# Altium project Mother_board_sauvc_2025.PrjPcb
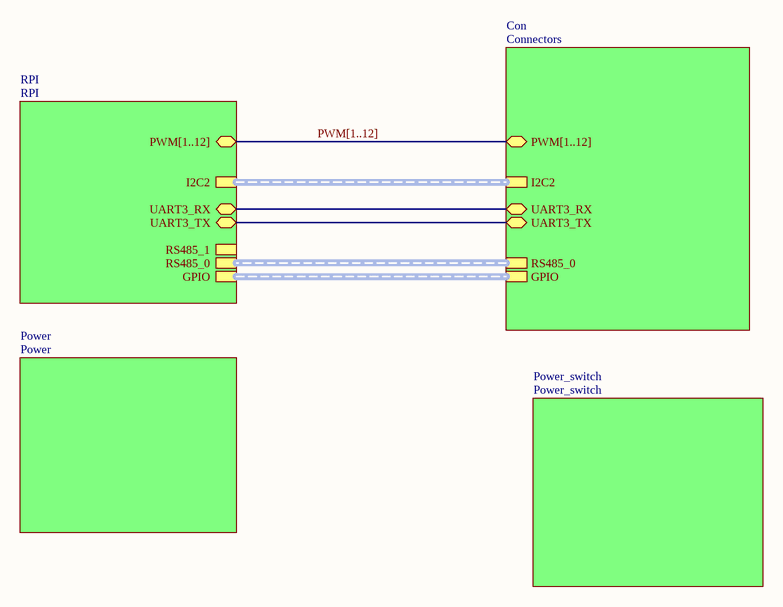
[diagram p0: Mother_board_sauvc_2025.SchDoc]
5 sheets, 47 parts. Net scope: hierarchical (ports join the sheet entries above them; power ports are global).
Board file: Mother_board_sauvc_2025.PcbDoc
Sheets:
  Mother_board_sauvc_2025.SchDoc
    RPI = RPI.SchDoc
    Con = Connectors.SchDoc
    Power = Power.SchDoc
    Power_switch = Power_switch.SchDoc

## Sheet Mother_board_sauvc_2025.SchDoc
size A4; SheetNumber: 1; SheetTotal: 5

### Sub-sheets
Con = Connectors: PWM[1..12] (bidir), I2C2 (harness *), UART3_RX (bidir), UART3_TX (bidir), GPIO (harness GPIO), RS485_0 (harness RS485_0)
Power = Power: no entries
Power_switch = Power_switch: no entries
RPI = RPI: PWM[1..12] (bidir), I2C2 (harness *), UART3_RX (bidir), UART3_TX (bidir), RS485_1 (harness RS485_1), RS485_0 (harness RS485_0), GPIO (harness GPIO)

### Nets
UART3_RX: sheet RPI/UART3_RX, sheet Con/UART3_RX
UART3_RX: sheet RPI/UART3_TX, sheet Con/UART3_TX  [a separate net that carries the same name]

### Buses and harness runs
bus PWM[1..12] = sheet Con/PWM[1..12] = sheet RPI/PWM[1..12]
harness sheet Con/GPIO = sheet RPI/GPIO
harness sheet Con/I2C2 = sheet RPI/I2C2
harness sheet Con/RS485_0 = sheet RPI/RS485_0

## Sheet RPI.SchDoc
size A3; SheetNumber: 3; SheetTotal: 5
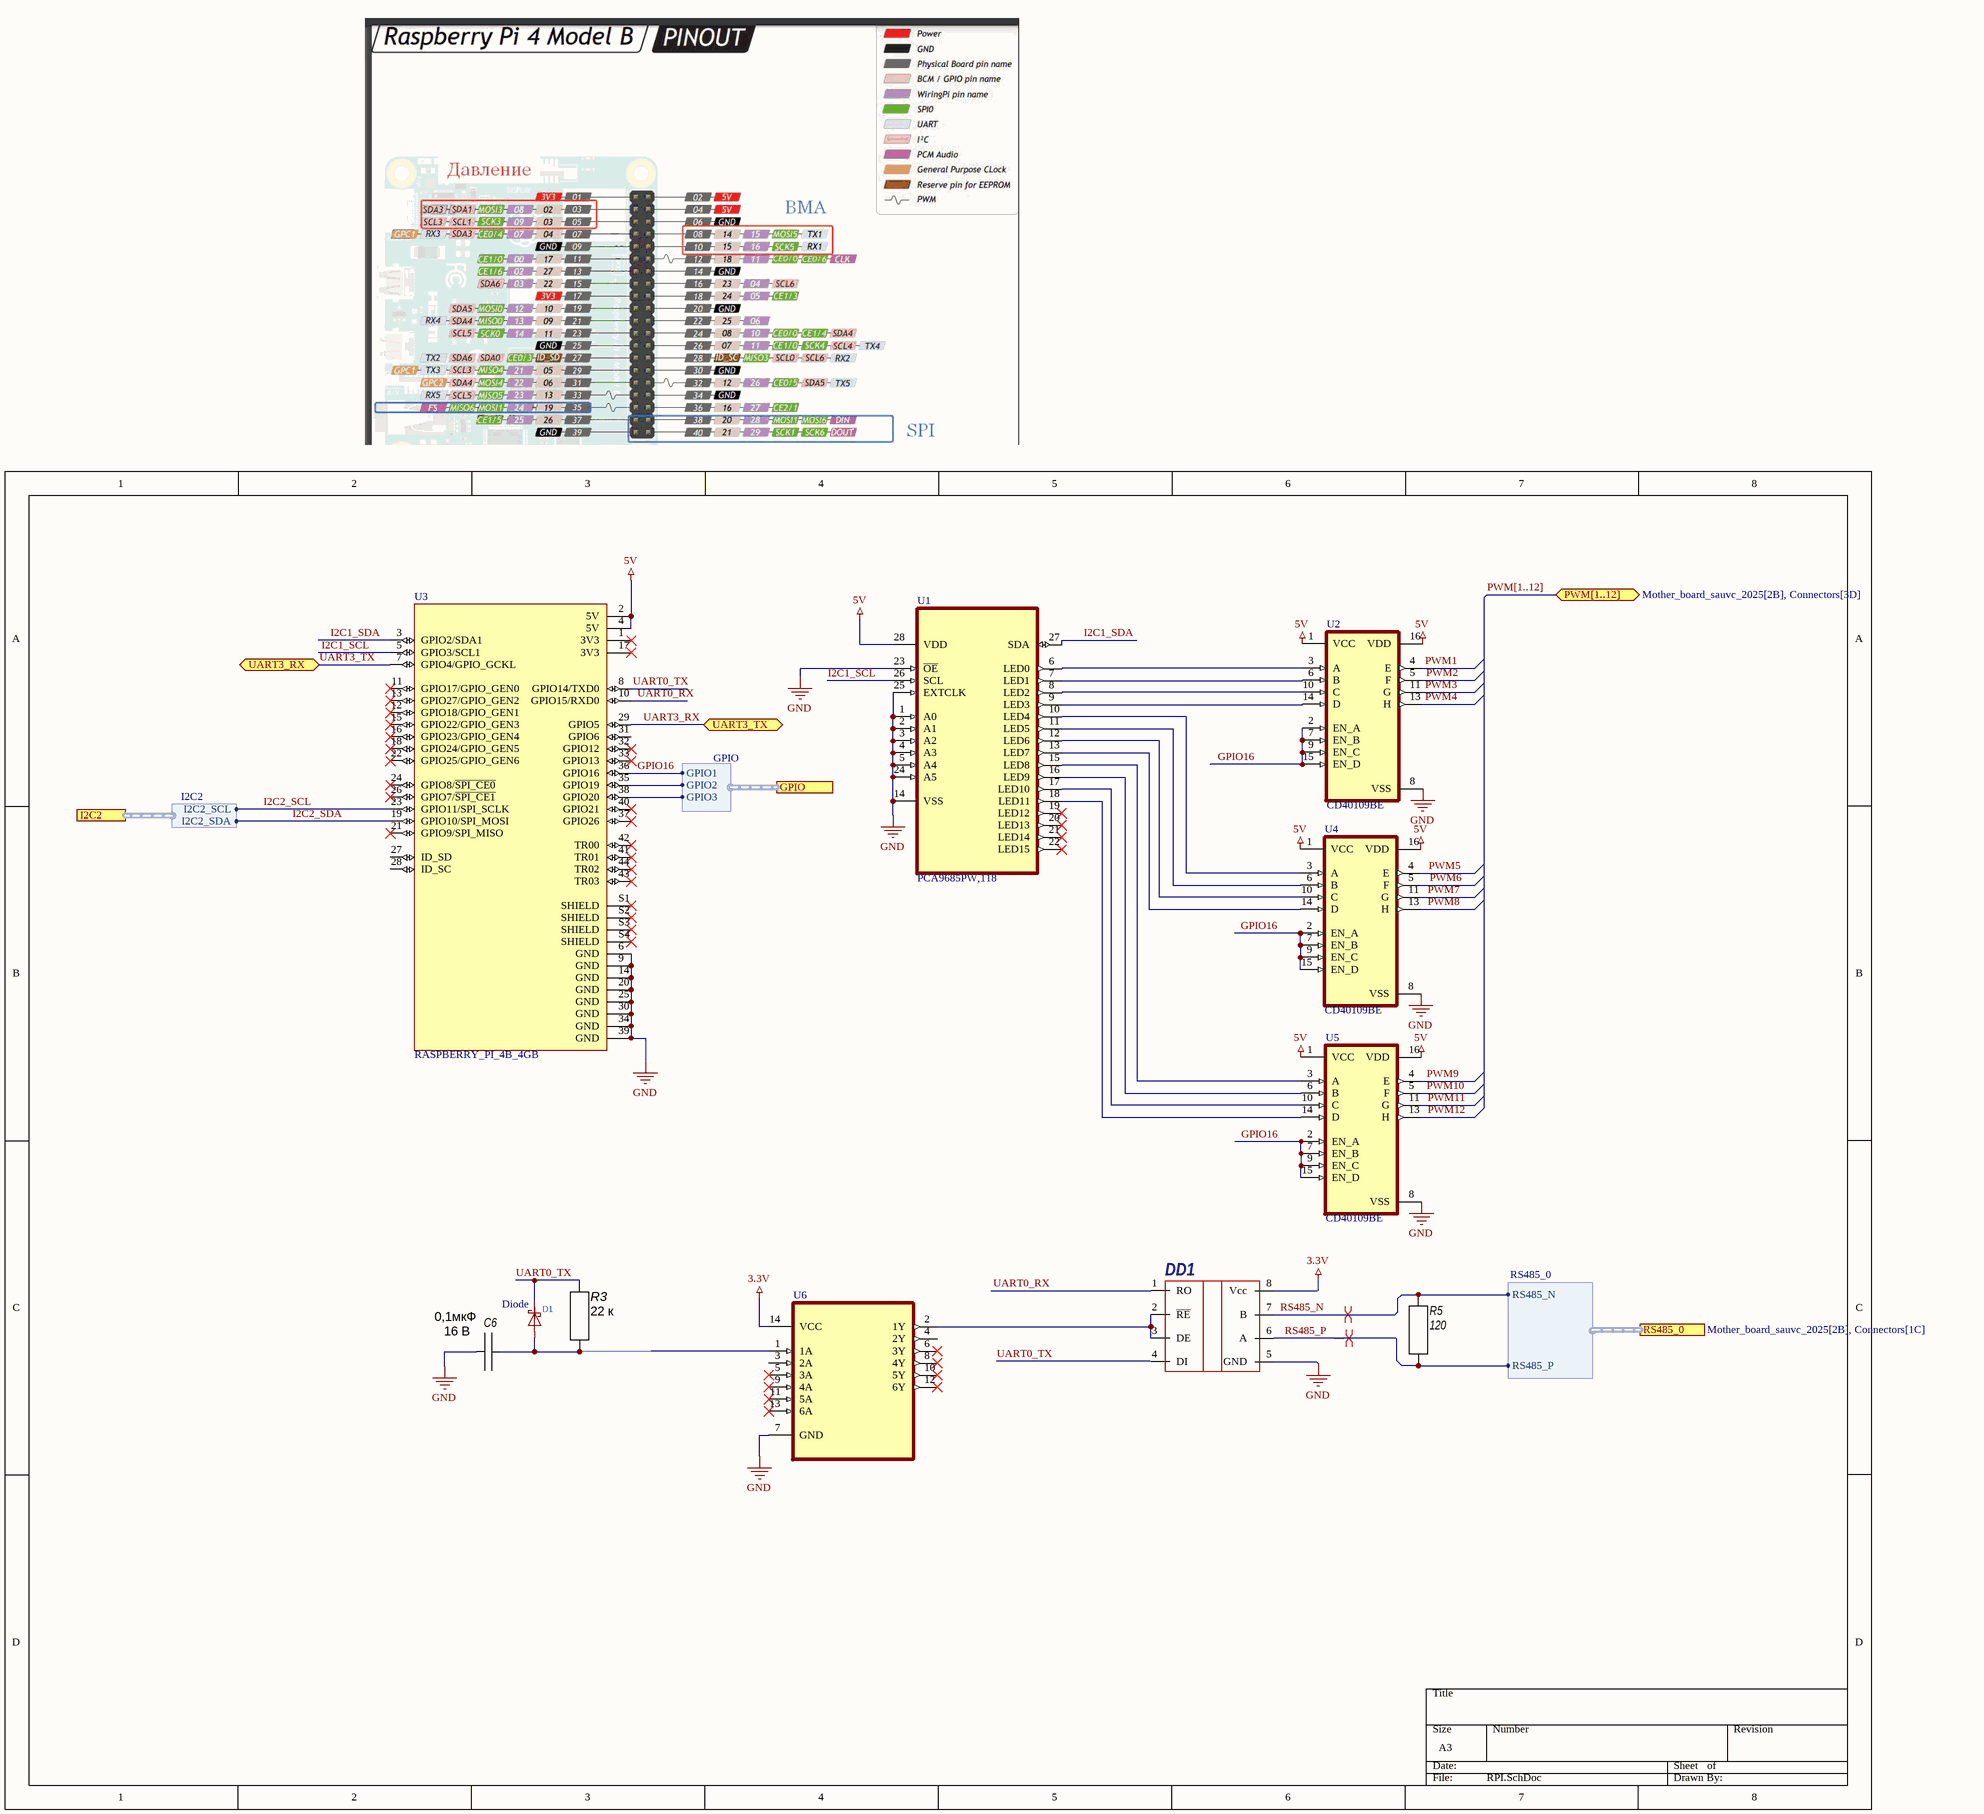
[diagram p1: RPI.SchDoc]

### Parts
C6  Voltage: 16 В  [C0603C]  (hidden comment: 0,1мкФ)
D1  Diode  [SOD-123F]
DD1  (no value)  [SOIC8N]
R3  22 к  [C0603R]
R5  120  [C0603R]
U1  PCA9685PW,118  [SOP65P640X110-28N]
U2  CD40109BE  [DIP794W45P254L1969H508Q16]
U3  RASPBERRY_PI_4B_4GB  [PLD40]
U4  CD40109BE  [DIP794W45P254L1969H508Q16]
U5  CD40109BE  [DIP794W45P254L1969H508Q16]
U6  (no value)  [SOIC127P600X175-14N]

### Ports
GPIO (harness GPIO, see Mother_board_sauvc_2025[2B], Connectors[1C]), I2C2 (harness I2C2, see Mother_board_sauvc_2025[2B], Connectors[3B]), PWM[1..12] (bidir, see Mother_board_sauvc_2025[2B], Connectors[3D]), RS485_0 (harness RS485_0, see Mother_board_sauvc_2025[2B], Connectors[1C]), UART3_RX (bidir, see Mother_board_sauvc_2025[2B], Connectors[3C]), UART3_TX (bidir, see Mother_board_sauvc_2025[2B], Connectors[3C])

### Harnesses
I2C2: I2C2_SCL, I2C2_SDA
GPIO: GPIO2, GPIO3, GPIO1
RS485_0: RS485_N, RS485_P

### Nets
3.3V: DD1.8(Vcc) U6.14(VCC)
5V: U1.28(VDD) U2.1(VCC) U2.16(VDD) U3.2(5V) U3.4(5V) U4.1(VCC) U4.16(VDD) U5.1(VCC) U5.16(VDD)
GND: C6.2 DD1.5(GND) U1.1(A0) U1.2(A1) U1.3(A2) U1.4(A3) U1.5(A4) U1.14(VSS) U1.23(~{OE}) U1.24(A5) U1.25(EXTCLK) U2.8(VSS) U3.6(GND) U3.9(GND) U3.14(GND) U3.20(GND) U3.25(GND) U3.30(GND) U3.34(GND) U3.39(GND) U4.8(VSS) U5.8(VSS) U6.7(GND)
GPIO16: U2.2(EN_A) U2.7(EN_B) U2.9(EN_C) U2.15(EN_D) U3.36(GPIO16) U4.2(EN_A) U4.7(EN_B) U4.9(EN_C) U4.15(EN_D) U5.2(EN_A) U5.7(EN_B) U5.9(EN_C) U5.15(EN_D) ; port GPIO.GPIO1
I2C1_SCL: U1.26(SCL) U3.5(GPIO3/SCL1)
I2C1_SDA: U1.27(SDA) U3.3(GPIO2/SDA1)
I2C2_SCL: U3.23(GPIO11/SPI_SCLK) ; port I2C2.I2C2_SCL
I2C2_SDA: U3.19(GPIO10/SPI_MOSI) ; port I2C2.I2C2_SDA
PWM1: U2.4(E)
PWM2: U2.5(F)
PWM3: U2.11(G)
PWM4: U2.13(H)
PWM5: U4.4(E)
PWM6: U4.5(F)
PWM7: U4.11(G)
PWM8: U4.13(H)
PWM9: U5.4(E)
PWM10: U5.5(F)
PWM11: U5.11(G)
PWM12: U5.13(H)
RS485_N: DD1.7(B) R5.1 ; port RS485_0.RS485_N
RS485_P: DD1.6(A) R5.2 ; port RS485_0.RS485_P
UART0_RX: DD1.1(RO) U3.10(GPIO15/RXD0)
UART0_TX: D1.K DD1.4(DI) R3.1 U3.8(GPIO14/TXD0)
UART3_RX: U3.29(GPIO5) ; port UART3_TX
UART3_TX: U3.7(GPIO4/GPIO_GCKL) ; port UART3_RX  [project net UART3_RX]
NetC6_1: C6.1 D1.A R3.2 U6.1(1A)
NetDD1_2: DD1.2(~{RE}) DD1.3(DE) U6.2(1Y)
NetU1_6: U1.6(LED0) U2.3(A)
NetU1_7: U1.7(LED1) U2.6(B)
NetU1_8: U1.8(LED2) U2.10(C)
NetU1_9: U1.9(LED3) U2.14(D)
NetU1_10: U1.10(LED4) U4.3(A)
NetU1_11: U1.11(LED5) U4.6(B)
NetU1_12: U1.12(LED6) U4.10(C)
NetU1_13: U1.13(LED7) U4.14(D)
NetU1_15: U1.15(LED8) U5.3(A)
NetU1_16: U1.16(LED9) U5.6(B)
NetU1_17: U1.17(LED10) U5.10(C)
NetU1_18: U1.18(LED11) U5.14(D)
NetU3_35: U3.35(GPIO19) ; port GPIO.GPIO2
NetU3_38: U3.38(GPIO20) ; port GPIO.GPIO3

Not connected (* = marked no-connect by the designer): U1 19(LED12)* 20(LED13)* 21(LED14)* 22(LED15)*; U3 1(3V3)* 11(GPIO17/GPIO_GEN0)* 12(GPIO18/GPIO_GEN1)* 13(GPIO27/GPIO_GEN2)* 15(GPIO22/GPIO_GEN3)* 16(GPIO23/GPIO_GEN4)* 17(3V3)* 18(GPIO24/GPIO_GEN5)* 21(GPIO9/SPI_MISO)* 22(GPIO25/GPIO_GEN6)* 24(GPIO8/~{SPI_CE0})* 26(GPIO7/~{SPI_CE1})* 27(ID_SD) 28(ID_SC) 31(GPIO6) 32(GPIO12)* 33(GPIO13)* 37(GPIO26)* 40(GPIO21)* 41(TR01)* 42(TR00)* 43(TR03)* 44(TR02)* S1(SHIELD)* S2(SHIELD)* S3(SHIELD)* S4(SHIELD)*; U6 3(2A) 4(2Y) 5(3A)* 6(3Y)* 8(4Y)* 9(4A)* 10(5Y)* 11(5A)* 12(6Y)* 13(6A)*

### Buses and harness runs
bus PWM[1..12] = port PWM[1..12]

### Layout directives
differential pair: RS485_N, RS485_P

### Library data of the parts
C6 = CL10B152KB8NNNC: SMD 0603 ; X7R; 1,5 нФ; 50 В; Manufacturer: SAMSUNG; Persent: ±15%; Type: Ceramic; Part Number: CL10B152KB8NNNC; Package: SMD 0603; Dielectric: X7R; ComponentLink1Description: Datasheet; Value: 0,1мкФ
D1 = Schottky-Diode: ki_description: Schottky Diode; Datasheet: https://diotec.com/de/produktliste/SBD.html; ki_keywords: Schottky
DD1 = MAX3072E: Half-duplex; Manufacturer: MAXIM; Rate: 3.3v; Notice: True fail-safe; Datasheet: https://static.chipdip.ru/lib/276/DOC000276899.pdf; Shop: https://www.chipdip.ru/product/max3072eesa; Case: soic-8(0.154 inch)
R3 = RC0603FR-0722KL: SMD 0603; 0,1; 1%; 22 кОм; Manufacturer: Yageo; Power: 0,1; TCR: 200 ppm; Part Number: RC0603FR-0722KL; Package: SMD 0603; Persent: 1%; Category: R; Value: 22 к
R5 = RC0603FR-07120RL: SMD 0603; 0,1; 1%; 120 Ом; Manufacturer: Yageo; Power: 0,1; TCR: 200 ppm; Part Number: RC0603FR-07120RL; Package: SMD 0603; Persent: 1%; Value: 120; Category: R
U1 = PCA9685PW,118: LED Driver IC 16 Output Linear - PWM Dimming 25mA 28-TSSOP; MF: NXP USA; Value: *; MP: PCA9685PW,118; Purchase-URL: https://pricing.snapeda.com/search/part/PCA9685PW,118/?ref=eda; Availability: In Stock; Price: None; Package: TSSOP-28 NXP Semiconductors
U2 U4 U5 = CD40109BE: Ð§ÐµÑ‚Ñ‹Ñ€ÐµÑ…ÑŠÑÐ´ÐµÑ€Ð½Ñ‹Ð¹ ÐšÐœÐžÐŸ-Ð¿Ñ€ÐµÐ¾Ð±Ñ€Ð°Ð·Ð¾Ð²Ð°Ñ‚ÐµÐ»ÑŒ Ð½Ð¸Ð·ÐºÐ¾Ð³Ð¾ Ð½Ð°Ð¿Ñ€ÑÐ¶ÐµÐ½Ð¸Ñ Ð² Ð²Ñ‹ÑÐ¾ÐºÐ¾Ðµ (Ð½Ð¾Ð¼Ð¸Ð½Ð°Ð»ÑŒÐ½Ð¾Ðµ Ð½Ð°Ð¿Ñ€ÑÐ¶ÐµÐ½Ð¸Ðµ 20 Ð’); MF: Texas Instruments; SnapEDA_Link: https://www.snapeda.com/parts/CD40109BE/Texas+Instruments/view-part/?ref=snap; Package: PDIP-16 Texas Instruments; Value: *; MP: CD40109BE; Check_prices: https://www.snapeda.com/parts/CD40109BE/Texas+Instruments/view-part/?ref=eda
U3 = RASPBERRY_PI_4B_4GB: BCM2711 Raspberry Pi 4 Model B 4GB - ARMÂ® CortexÂ®-A72 MPU Embedded Evaluation Board; MP: RASPBERRY PI 4B/4GB; Price: None; MF: Raspberry Pi; Check_prices: https://www.snapeda.com/parts/RASPBERRY%20PI%204B/4GB/Raspberry+Pi/view-part/?ref=eda; Value: *; Purchase-URL: https://pricing.snapeda.com/search/part/RASPBERRY PI 4B/4GB/?ref=eda; Availability: In Stock; SnapEDA_Link: https://www.snapeda.com/parts/RASPBERRY%20PI%204B/4GB/Raspberry+Pi/view-part/?ref=snap; Package: None
U6 = 74HC14D: Inverter IC 6 Channel Schmitt Trigger 14-SOIC; MF: Toshiba; SnapEDA_Link: https://www.snapeda.com/parts/74HC14D/Toshiba+Semiconductor+and+Storage/view-part/?ref=snap; Availability: In Stock; Price: None; Package: SO14-14 Nexperia USA Inc.; Purchase-URL: https://pricing.snapeda.com/search/part/74HC14D/?ref=eda; Check_prices: https://www.snapeda.com/parts/74HC14D/Toshiba+Semiconductor+and+Storage/view-part/?ref=eda; Value: *; MP: 74HC14D

## Sheet Connectors.SchDoc
size A4; SheetNumber: 4; SheetTotal: 5
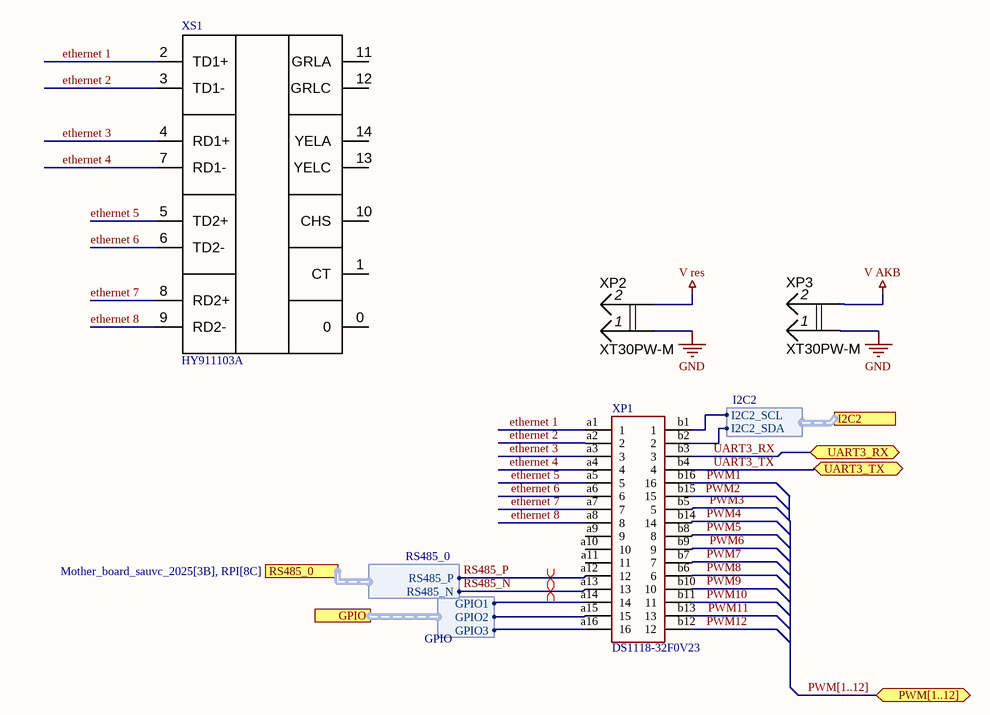
[diagram p2: Connectors.SchDoc]

### Parts
XP1  DS1118-32F0V23  [DS1118-32M0R23]
XP2  XT30PW-M  [XT30PW-M]
XP3  XT30PW-M  [XT30PW-M]
XS1  HY911103A  [HY911103A_HAN]

### Ports
GPIO (harness GPIO, see Mother_board_sauvc_2025[3B], RPI[4A]), I2C2 (harness I2C2, see Mother_board_sauvc_2025[3B], RPI[1B]), PWM[1..12] (bidir, see Mother_board_sauvc_2025[3B], RPI[7A]), RS485_0 (harness RS485_0, see Mother_board_sauvc_2025[3B], RPI[8C]), UART3_RX (bidir, see Mother_board_sauvc_2025[3B], RPI[2A]), UART3_TX (bidir, see Mother_board_sauvc_2025[3B], RPI[3A])

### Harnesses
GPIO: GPIO1, GPIO2, GPIO3
RS485_0: RS485_P, RS485_N
I2C2: I2C2_SCL, I2C2_SDA

### Nets
GND: XP2.1 XP3.1
V AKB: XP3.2
V res: XP2.2
ethernet 1: XP1.a1(1) XS1.2(TD1+)
ethernet 2: XP1.a2(2) XS1.3(TD1-)
ethernet 3: XP1.a3(3) XS1.4(RD1+)
ethernet 4: XP1.a4(4) XS1.7(RD1-)
ethernet 5: XP1.a5(5) XS1.5(TD2+)
ethernet 6: XP1.a6(6) XS1.6(TD2-)
ethernet 7: XP1.a7(7) XS1.8(RD2+)
ethernet 8: XP1.a8(8) XS1.9(RD2-)
GPIO16: XP1.a14(14) ; port GPIO.GPIO1
I2C2_SCL: XP1.b1(1) ; port I2C2.I2C2_SCL
I2C2_SDA: XP1.b2(2) ; port I2C2.I2C2_SDA
PWM1: XP1.b16(16)
PWM2: XP1.b15(15)
PWM3: XP1.b5(5)
PWM4: XP1.b14(14)
PWM5: XP1.b8(8)
PWM6: XP1.b9(9)
PWM7: XP1.b7(7)
PWM8: XP1.b6(6)
PWM9: XP1.b10(10)
PWM10: XP1.b11(11)
PWM11: XP1.b13(13)
PWM12: XP1.b12(12)
RS485_N: XP1.a13(13) ; port RS485_0.RS485_N
RS485_P: XP1.a12(12) ; port RS485_0.RS485_P
UART3_RX: XP1.b3(3) ; port UART3_RX
UART3_TX: XP1.b4(4) ; port UART3_TX  [project net UART3_RX]
NetU3_35: XP1.a15(15) ; port GPIO.GPIO2
NetU3_38: XP1.a16(16) ; port GPIO.GPIO3

Not connected (* = marked no-connect by the designer): XP1 a9(9) a10(10) a11(11); XS1 0 1(CT) 10(CHS) 11(GRLA) 12(GRLC) 13(YELC) 14(YELA)

### Buses and harness runs
bus PWM[1..12] = port PWM[1..12]

### Layout directives
differential pair: RS485_N, RS485_P

### Library data of the parts
XP2 XP3 = XT30PW-M: Manufacturer: AMASS; Type: XT; Part Number: XT30PW-M
XS1 = HY911103A: RG45; Manufacturer: HanRun; Part Number: HY911103A; Type: RG45

## Sheet Power.SchDoc
size A4; SheetNumber: 2; SheetTotal: 5
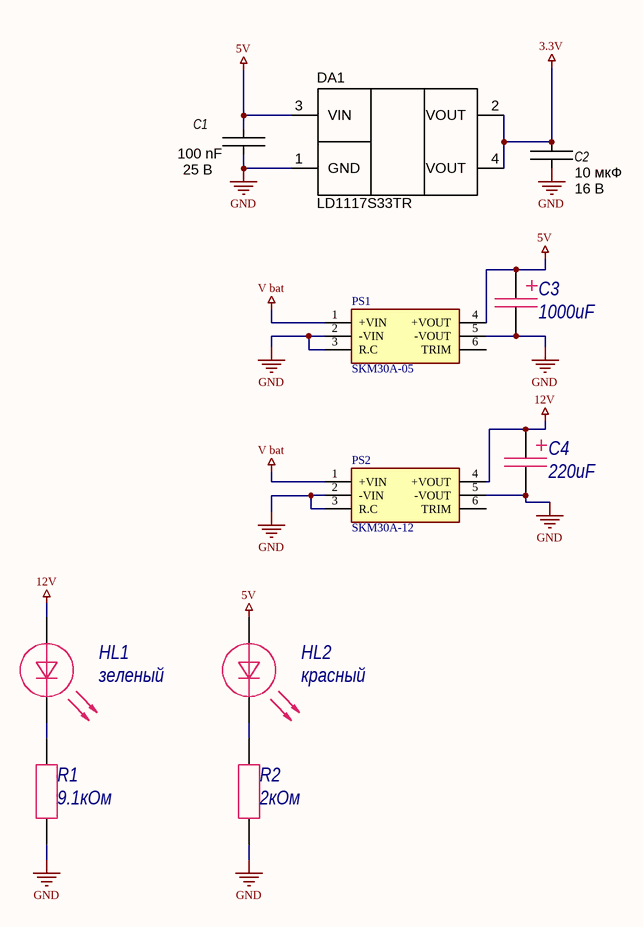
[diagram p3: Power.SchDoc]

### Parts
C1  Voltage: 25 В  [C0402C]  (hidden comment: 100 nF)
C2  Voltage: 16 В  [C0805C]  (hidden comment: 10 мкФ)
C3  value 1000uF  [Capacitor 8x12]  (hidden comment: 1uF)
C4  value 220uF  [Capacitor 8x12]  (hidden comment: 1uF)
DA1  LD1117S33TR  [SOT-223]
HL1  Color: зеленый  [0805D]
HL2  Color: красный  [0805D]
PS1  SKM30A-05  [SKM30A05]
PS2  SKM30A-12  [SKM30B12]
R1  value 9.1кОм  [0805R]  (hidden comment: Resistor)
R2  value 2кОм  [0805R]  (hidden comment: Resistor)

### Nets
3.3V: C2.1 DA1.2(VOUT) DA1.4(VOUT)
5V: C1.1 C3.1 DA1.3(VIN) HL2.1 PS1.4(+VOUT)
12V: C4.1 HL1.1 PS2.4(+VOUT)
GND: C1.2 C2.2 C3.2 C4.2 DA1.1(GND) PS1.2(-VIN) PS1.3(R.C) PS1.5(-VOUT) PS2.2(-VIN) PS2.3(R.C) PS2.5(-VOUT) R1.1 R2.1
V bat: PS1.1(+VIN) PS2.1(+VIN)
NetHL1_2: HL1.2 R1.2
NetHL2_2: HL2.2 R2.2

Not connected (* = marked no-connect by the designer): PS1 6(TRIM); PS2 6(TRIM)

### Library data of the parts
C1 = CL05B103KA5NNNC: SMD 0603 ; X7R; 0,01 мкФ; 25 В; Manufacturer: SAMSUNG; Persent: ±10%; Type: Ceramic; Part Number: CL05B103KA5NNNC; Package: SMD 0402; Dielectric: X7R; ComponentLink1Description: Datasheet; Value: 100 nF
C2 = CL21B106KOQNNNE: SMD 0805; X7R; 10 мкФ; 16 В; Manufacturer: SAMSUNG; Persent: ±15%; Type: Ceramic; Part Number: CL21B106KOQNNNE; Package: SMD 0805; Dielectric: X7R; ComponentLink1Description: Datasheet; Value: 10 мкФ
C3 C4 = Capacitor_pol
DA1 = LD1117S33TR: Linear regulator, 3V3; Manufacturer: STMicroelectronics; Type: Linear regulator; Part Number: LD1117S33TR
HL1 HL2 = LED: Manufacturer: -; Rate: -; Datasheet: -; Shop: -; Notice: -; Case: -
PS1 = SKM30A-05: Power Supply; Manufacturer_Name: Mean Well; Datasheet Link: https://www.meanwell.com/webapp/product/search.aspx?prod=SKM30; Height: 11.2mm; Manufacturer_Part_Number: SKM30A-05; Mouser Part Number: 709-SKM30A-05; Mouser Price/Stock: https://www.mouser.co.uk/ProductDetail/MEAN-WELL/SKM30A-05?qs=WtedIhRlNpsvgfTGPi4UAw%3D%3D
PS2 = SKM30A-12: Power Supply; Manufacturer_Name: Mean Well; Datasheet Link: https://www.meanwell.com/webapp/product/search.aspx?prod=SKM30; Height: 11.2mm; Manufacturer_Part_Number: SKM30A-12; Mouser Part Number: 709-SKM30A-12; Mouser Price/Stock: https://www.mouser.co.uk/ProductDetail/MEAN-WELL/SKM30A-12?qs=WtedIhRlNpuG9wDURm5lSA%3D%3D; Arrow Part Number: SKM30A-12; Arrow Price/Stock: https://www.arrow.com/en/products/skm30a-12/mean-well-enterprises

## Sheet Power_switch.SchDoc
size A4; SheetNumber: 5; SheetTotal: 5
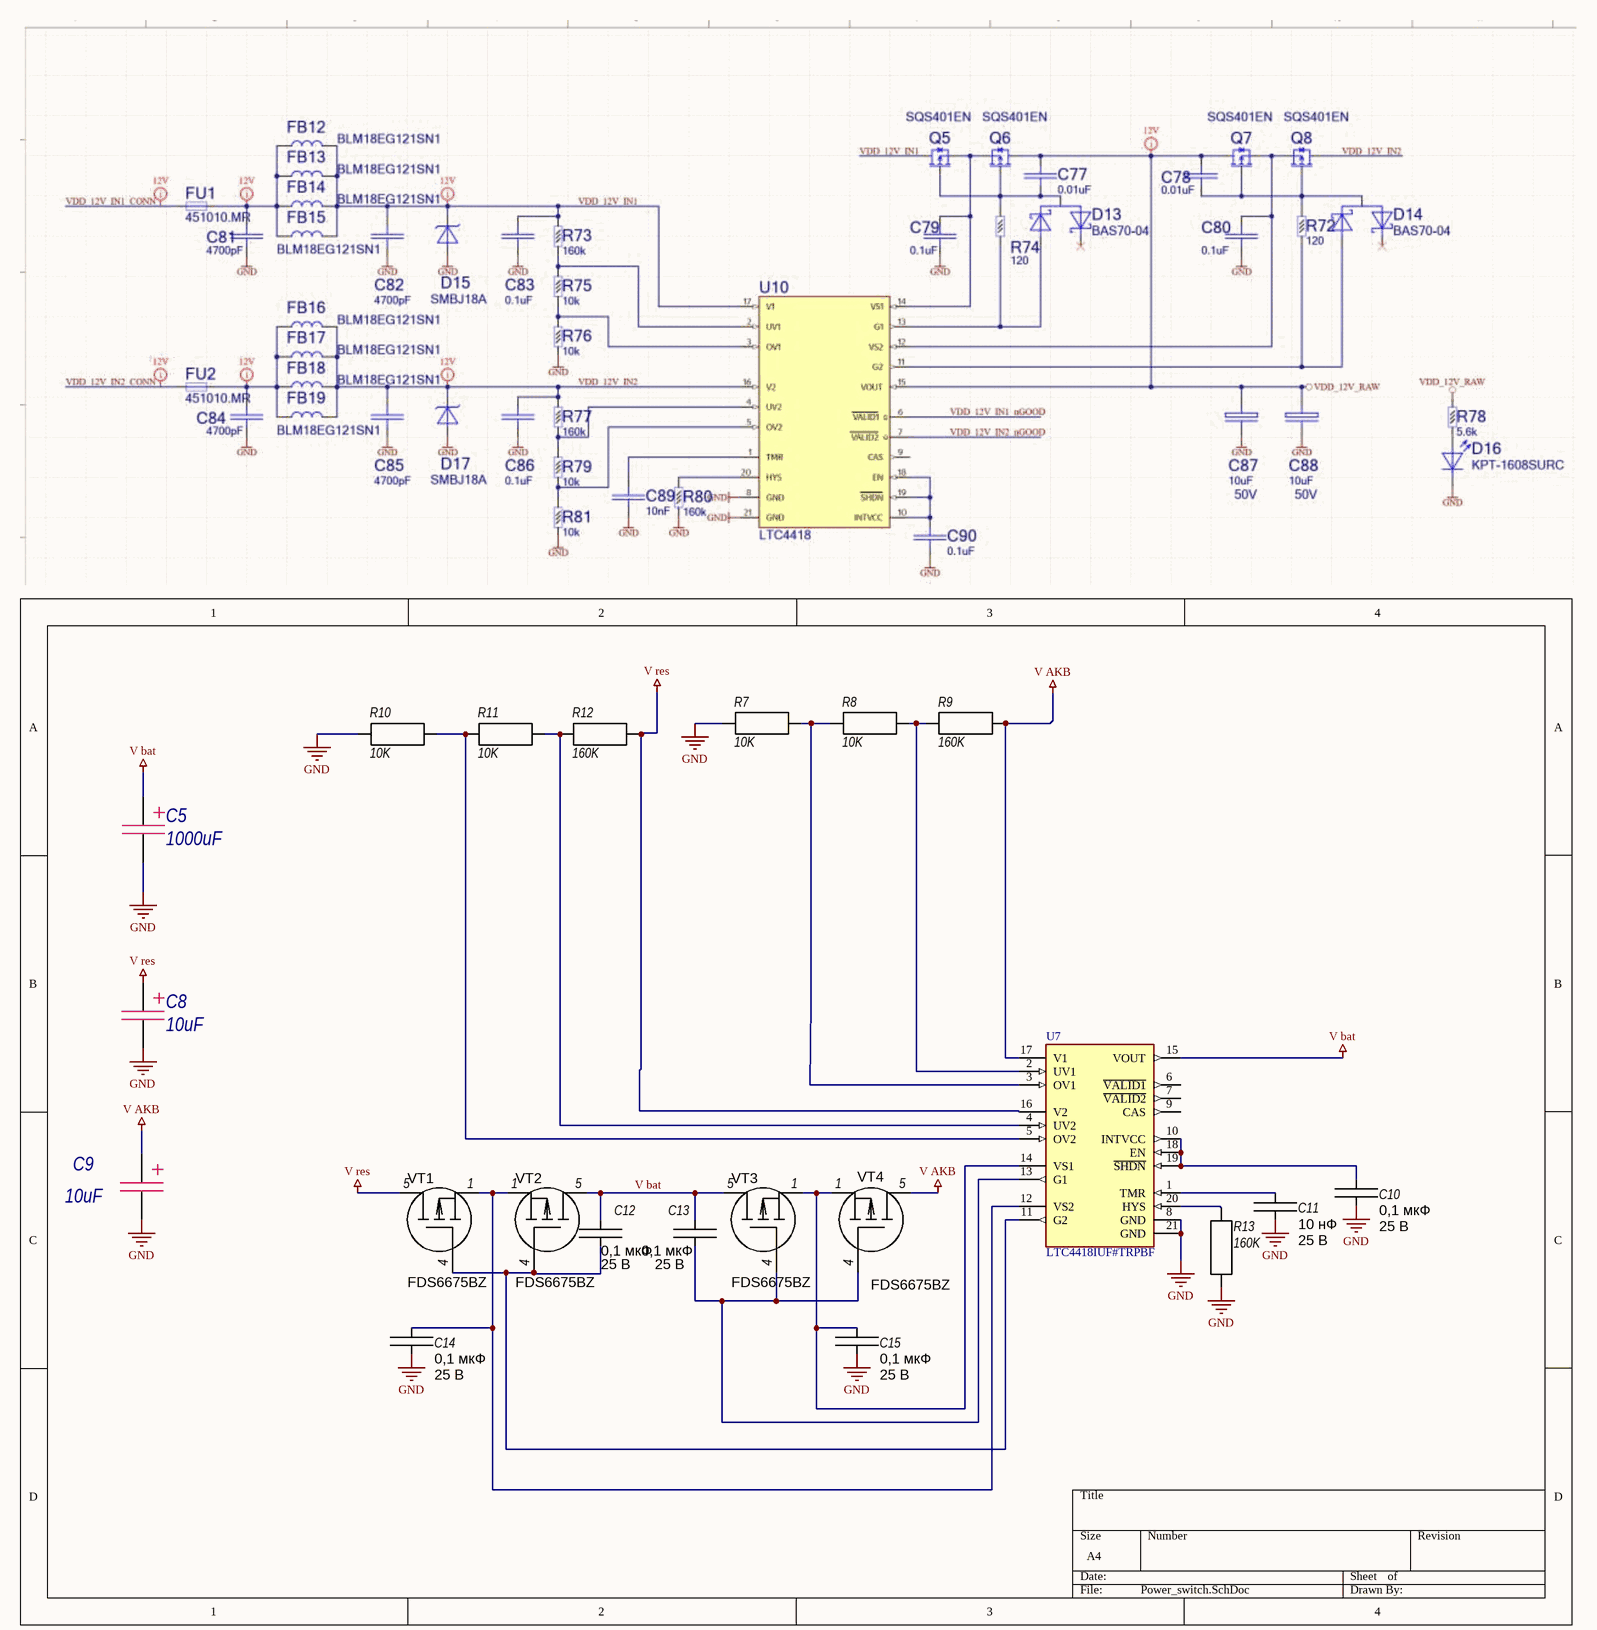
[diagram p4: Power_switch.SchDoc]

### Parts
C5  value 1000uF  [Capacitor 10x12]  (hidden comment: 1uF)
C8  value 10uF  [Capacitor 8x12]  (hidden comment: 1uF)
C9  value 10uF  [Capacitor 8x12]  (hidden comment: 1uF)
C10  Voltage: 25 В  [C0402C]  (hidden comment: 0,1 мкФ)
C11  Voltage: 25 В  [C0402C]  (hidden comment: 10 нФ)
C12  Voltage: 25 В  [C0402C]  (hidden comment: 0,1 мкФ)
C13  Voltage: 25 В  [C0402C]  (hidden comment: 0,1 мкФ)
C14  Voltage: 25 В  [C0402C]  (hidden comment: 0,1 мкФ)
C15  Voltage: 25 В  [C0402C]  (hidden comment: 0,1 мкФ)
R7  10K  [C0603R]
R8  10K  [C0603R]
R9  160K  [C0603R]
R10  10K  [C0603R]
R11  10K  [C0603R]
R12  160K  [C0603R]
R13  160K  [C0603R]
U7  LTC4418IUF#TRPBF  [QFN50P400X400X80-21N]
VT1  Part Number: FDS6675BZ  [SOIC-8]  (hidden comment: IRF7240PBF)
VT2  Part Number: FDS6675BZ  [SOIC-8]  (hidden comment: IRF7240PBF)
VT3  Part Number: FDS6675BZ  [SOIC-8]  (hidden comment: IRF7240PBF)
VT4  Part Number: FDS6675BZ  [SOIC-8]  (hidden comment: IRF7240PBF)

### Nets
D: VT1.6(D) VT1.7(D) VT1.8(D) VT2.6(D) VT2.7(D) VT2.8(D) VT3.6(D) VT3.7(D) VT3.8(D) VT4.4(G) VT4.7(D) VT4.8(D)
GND: C5.2 C8.2 C9.2 C10.2 C11.2 C14.2 C15.2 R7.2 R10.2 R13.2 U7.8(GND) U7.21(GND)
S: VT1.2(S) VT1.3(S) VT2.2(S) VT2.3(S) VT3.2(S) VT3.3(S) VT4.2(S) VT4.3(S)
V AKB: C9.1 R9.1 U7.17(V1) VT4.5(D)
V bat: C5.1 C12.1 C13.1 U7.15(VOUT) VT2.5(D) VT3.5(D)
V res: C8.1 R12.1 U7.16(V2) VT1.5(D)
NetC10_1: C10.1 U7.10(INTVCC) U7.18(EN) U7.19(~{SHDN})
NetC11_1: C11.1 U7.1(TMR)
NetC12_2: C12.2 U7.11(G2) VT1.4(G) VT2.4(G)
NetC13_2: C13.2 U7.13(G1) VT3.4(G) VT4.4(G)
NetC14_1: C14.1 U7.12(VS2) VT1.1(S) VT2.1(S)
NetC15_1: C15.1 U7.14(VS1) VT3.1(S) VT4.1(S)
NetR7_1: R7.1 R8.2 U7.3(OV1)
NetR8_1: R8.1 R9.2 U7.2(UV1)
NetR10_1: R10.1 R11.2 U7.5(OV2)
NetR11_1: R11.1 R12.2 U7.4(UV2)
NetR13_1: R13.1 U7.20(HYS)

Not connected (* = marked no-connect by the designer): U7 6(~{VALID1}) 7(~{VALID2}) 9(CAS)

### Library data of the parts
C5 C8 C9 = Capacitor_pol
C10-C15 = CL05B104KA5NNNC: SMD 0402 ; X7R; 0,1 мкФ; 25 В; Manufacturer: SAMSUNG; Persent: ±10%; Type: Ceramic; Part Number: CL05B104KA5NNNC; Package: SMD 0402; Dielectric: X7R; ComponentLink1Description: Datasheet
  C10 C12-C15: Value: 0,1 мкФ
  C11: Value: 10 нФ
R7-R13 = RC0603FR-0759KL: SMD 0603; 0,1; 1%; 59 кОм; Manufacturer: Yageo; Power: 0,1; Value: 59 к; TCR: 200 ppm; Part Number: RC0603FR-0759KL; Package: SMD 0603; Persent: 1%; Category: R
U7 = LTC4418IUF#TRPBF: OR Controller Source Selector Switch P-Channel 2:1 20-QFN _4x4_; MF: Analog Devices; SnapEDA_Link: https://www.snapeda.com/parts/LTC4418IUF%23TRPBF/Analog%20Devices/view-part/2882983/?ref=snap; MP: LTC4418IUF#TRPBF; Price: None; Availability: Unavailable; Value: *; Package: QFN -20 Analog Devices
VT1-VT4 = IRF7240PBF: P MOSFET; Manufacturer: Infineon; Type: MOSFET; Сharacter: P

## Nets that join several sheets
3.3V: RPI (DD1.8 U6.14), Power (C2.1 DA1.2 DA1.4)
5V: RPI (9 pins), Power (5 pins)
GND: RPI (23 pins), Connectors (XP2.1 XP3.1), Power (13 pins), Power_switch (12 pins)
V AKB: Connectors (XP3.2), Power_switch (C9.1 R9.1 U7.17 VT4.5)
V bat: Power (PS1.1 PS2.1), Power_switch (6 pins)
V res: Connectors (XP2.2), Power_switch (C8.1 R12.1 U7.16 VT1.5)
GPIO16: RPI (13 pins), Connectors (XP1.a14)
I2C2_SCL: RPI (U3.23), Connectors (XP1.b1)
I2C2_SDA: RPI (U3.19), Connectors (XP1.b2)
NetU3_35: RPI (U3.35), Connectors (XP1.a15)
NetU3_38: RPI (U3.38), Connectors (XP1.a16)
PWM1: RPI (U2.4), Connectors (XP1.b16)
PWM2: RPI (U2.5), Connectors (XP1.b15)
PWM3: RPI (U2.11), Connectors (XP1.b5)
PWM4: RPI (U2.13), Connectors (XP1.b14)
PWM5: RPI (U4.4), Connectors (XP1.b8)
PWM6: RPI (U4.5), Connectors (XP1.b9)
PWM7: RPI (U4.11), Connectors (XP1.b7)
PWM8: RPI (U4.13), Connectors (XP1.b6)
PWM9: RPI (U5.4), Connectors (XP1.b10)
PWM10: RPI (U5.5), Connectors (XP1.b11)
PWM11: RPI (U5.11), Connectors (XP1.b13)
PWM12: RPI (U5.13), Connectors (XP1.b12)
RS485_N: RPI (DD1.7 R5.1), Connectors (XP1.a13)
RS485_P: RPI (DD1.6 R5.2), Connectors (XP1.a12)
UART3_RX: RPI (U3.7), Connectors (XP1.b3)
UART3_RX: RPI (U3.29), Connectors (XP1.b4)